# Altium schematic sheet Group14ReceiverSchematic.SchDoc
size B; SheetNumber: 1; SheetTotal: 2
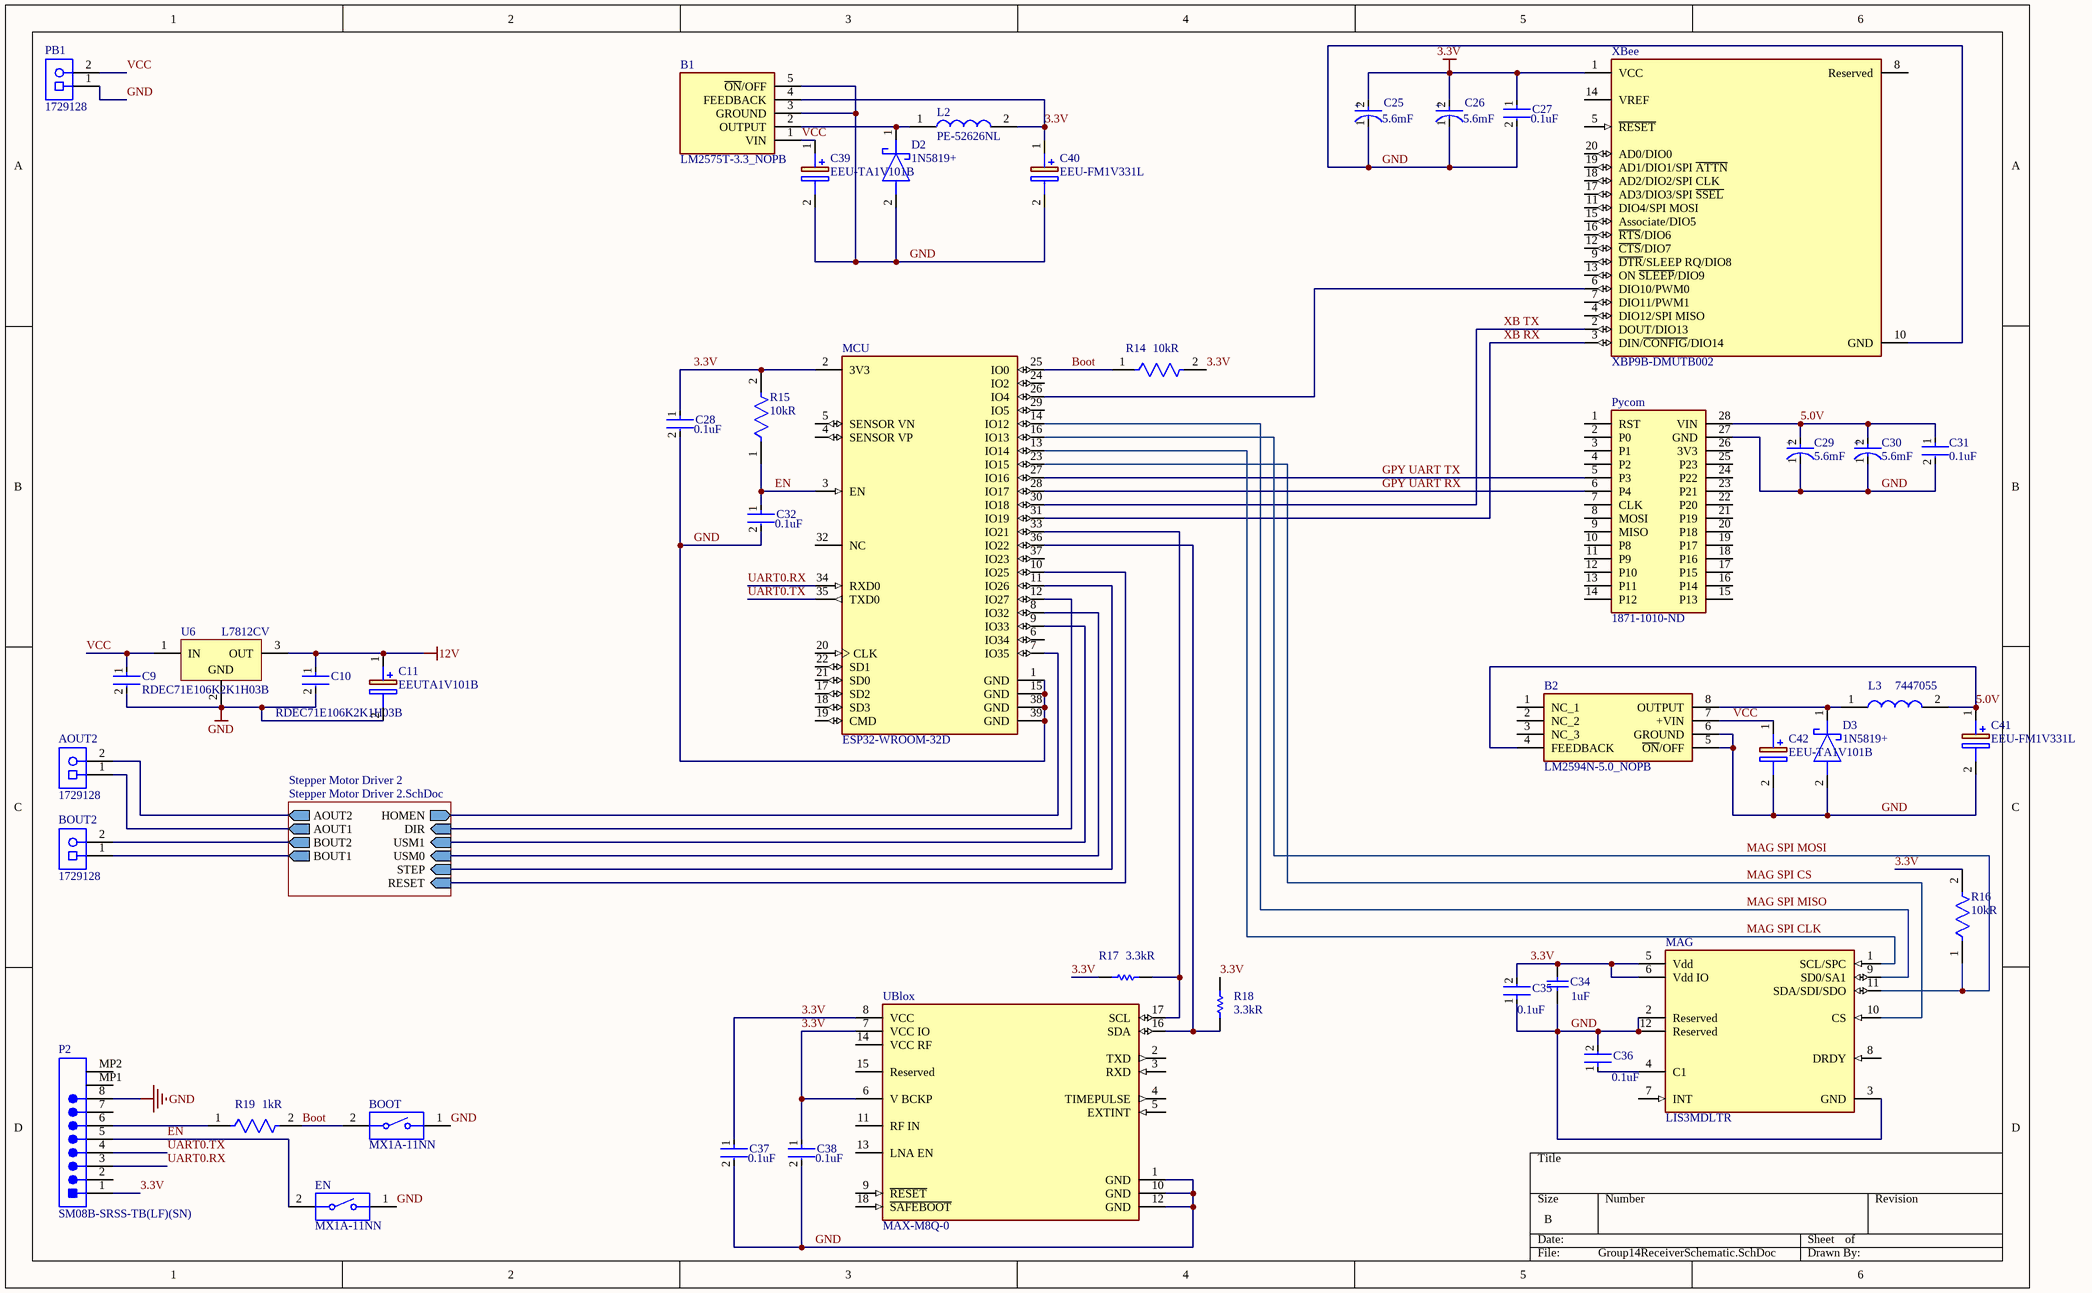
[diagram p0: Group14ReceiverSchematic.SchDoc]

## Parts
AOUT2  1729128  [PHOE-1729128-2_V]
B1  LM2575T-3.3_NOPB  [LM2575T33NOPB]
B2  LM2594N-5.0_NOPB  [DIP794W53P254L959H508Q8N]
BOOT  MX1A-11NN  [CHRY-MX1A-11NN_V]
BOUT2  1729128  [PHOE-1729128-2_V]
C9  RDEC71E106K2K1H03B  [FP-RDE2M1-MFG]
C10  RDEC71E106K2K1H03B  [FP-RDE2M1-MFG]
C11  EEUTA1V101B  [CAPPRD500W65D1000H1350]
C25  Capacitance: 5.6mF  [FP-RAD-TH-D_16_0_5-L_20_2-MFG]  (hidden comment: EEUFM0J562S)
C26  Capacitance: 5.6mF  [FP-RAD-TH-D_16_0_5-L_20_2-MFG]  (hidden comment: EEUFM0J562S)
C27  Capacitance: 0.1uF  [FP-RCE0K1-MFG]  (hidden comment: RCER71E104K0K1H03B)
C28  Capacitance: 0.1uF  [FP-RCE0K1-MFG]  (hidden comment: RCER71E104K0K1H03B)
C29  Capacitance: 5.6mF  [FP-RAD-TH-D_16_0_5-L_20_2-MFG]  (hidden comment: EEUFM0J562S)
C30  Capacitance: 5.6mF  [FP-RAD-TH-D_16_0_5-L_20_2-MFG]  (hidden comment: EEUFM0J562S)
C31  Capacitance: 0.1uF  [FP-RCE0K1-MFG]  (hidden comment: RCER71E104K0K1H03B)
C32  Capacitance: 0.1uF  [FP-RCE0K1-MFG]  (hidden comment: RCER71E104K0K1H03B)
C34  Capacitance: 1uF  [CAPC2013X140X50ML20T25]  (hidden comment: 0805YC105JAT2A)
C35  Capacitance: 0.1uF  [FP-RCE0K1-MFG]  (hidden comment: RCER71E104K0K1H03B)
C36  Capacitance: 0.1uF  [FP-RCE0K1-MFG]  (hidden comment: RCER71E104K0K1H03B)
C37  Capacitance: 0.1uF  [FP-RCE0K1-MFG]  (hidden comment: RCER71E104K0K1H03B)
C38  Capacitance: 0.1uF  [FP-RCE0K1-MFG]  (hidden comment: RCER71E104K0K1H03B)
C39  EEU-TA1V101B  [CAPPRD500W65D1000H1350]
C40  EEU-FM1V331L  [CAPPRD350W60D800H2200]
C41  EEU-FM1V331L  [CAPPRD350W60D800H2200]
C42  EEU-TA1V101B  [CAPPRD500W65D1000H1350]
D2  1N5819+  [DIOAD1410W86L470D235]
D3  1N5819+  [DIOAD1410W86L470D235]
EN  MX1A-11NN  [CHRY-MX1A-11NN_V]
L2  PE-52626NL  [PE52626NL]
L3  7447055  [7447055]
MAG  LIS3MDLTR  [FP-VFLGA-12-8365767-MFG]
MCU  ESP32-WROOM-32D  [FP-ESP32-WROOM-32D-MFG]
P2  SM08B-SRSS-TB(LF)(SN)  [JST-SM08B-SRSS-TB_V]
PB1  1729128  [PHOE-1729128-2_V]
Pycom  1871-1010-ND  [18711010ND]
R14  Resistance: 10kR  [FP-CR0805-IPC_A]  (hidden comment: CR0805-FX-1002ELF)
R15  Resistance: 10kR  [FP-CR0805-IPC_A]  (hidden comment: CR0805-FX-1002ELF)
R16  Resistance: 10kR  [FP-CR0805-IPC_A]  (hidden comment: CR0805-FX-1002ELF)
R17  Resistance: 3.3kR  [RESC1608X55X30NL20T10]  (hidden comment: RK73H1JTTD3301F)
R18  Resistance: 3.3kR  [RESC1608X55X30NL20T10]  (hidden comment: RK73H1JTTD3301F)
R19  1kR  [FP-RN732A-MFG]
U6  L7812CV  [TO220]
UBlox  MAX-M8Q-0  [FP-MAX-M8Q-0-MFG]
XBee  XBP9B-DMUTB002  [FP-XBP9B-DMUTB002-MFG]

## Sub-sheets
Stepper Motor Driver 2 = Stepper Motor Driver 2.SchDoc: HOMEN (out), DIR (in), USM1 (in), USM0 (in), STEP (in), RESET (in), AOUT1 (out), AOUT2 (out), BOUT2 (out), BOUT1 (out)

## Nets
3.3V: B1.4(FEEDBACK) C25.2(A) C26.2(A) C27.1 C28.1 C34.2 C35.2 C37.1 C38.1 C40.1(+) L2.2 MAG.5(Vdd) MAG.6(Vdd_IO) MCU.2(3V3) P2.1 R14.2 R15.2 R16.2 R17.2 R18.2 UBlox.6(V_BCKP) UBlox.7(VCC_IO) UBlox.8(VCC) XBee.1(VCC)
12V: C10.1 C11.1(+) U6.3(OUT)
GND: B1.3(GROUND) B1.5(~{ON}/OFF) B2.5(~{ON}/OFF) B2.6(GROUND) BOOT.1 C9.2 C10.2 C11.2(-) C25.1(C) C26.1(C) C27.2 C28.2 C29.1(C) C30.1(C) C31.2 C32.2 C34.1 C35.1 C36.2 C37.2 C38.2 C39.2(-) C40.2(-) C41.2(-) C42.2(-) D2.2(A) D3.2(A) EN.1 MAG.2(Reserved) MAG.3(GND) MAG.12(Reserved) MCU.1(GND) MCU.15(GND) MCU.38(GND) MCU.39(GND) P2.8 PB1.1 Pycom.27(GND) U6.2(GND) UBlox.1(GND) UBlox.10(GND) UBlox.12(GND) XBee.10(GND)
5.0V: B2.4(FEEDBACK) C29.2(A) C30.2(A) C31.1 C41.1(+) L3.2 Pycom.28(VIN)
Boot: BOOT.2 MCU.25(IO0) R14.1 R19.2
EN: C32.1 EN.2 MCU.3(EN) P2.5 R15.1
GPY UART RX: MCU.28(IO17) Pycom.6(P4)
GPY UART TX: MCU.27(IO16) Pycom.5(P3)
MAG SPI CLK: MAG.1(SCL/SPC) MCU.13(IO14)
MAG SPI CS: MAG.10(CS) MCU.23(IO15)
MAG SPI MISO: MAG.9(SD0/SA1) MCU.14(IO12)
MAG SPI MOSI: MAG.11(SDA/SDI/SDO) MCU.16(IO13) R16.1
UART0.RX: MCU.34(RXD0) P2.3
UART0.TX: MCU.35(TXD0) P2.4
VCC: B1.1(VIN) B2.7(+VIN) C9.1 C39.1(+) C42.1(+) PB1.2 U6.1(IN)
XB RX: MCU.31(IO19) XBee.3(DIN/~{CONFIG}/DIO14)
XB TX: MCU.30(IO18) XBee.2(DOUT/DIO13)
NetAOUT2_1: AOUT2.1 ; sheet Stepper Motor Driver 2/AOUT1
NetAOUT2_2: AOUT2.2 ; sheet Stepper Motor Driver 2/AOUT2
NetB1_2: B1.2(OUTPUT) D2.1(K) L2.1
NetB2_8: B2.8(OUTPUT) D3.1(K) L3.1
NetBOUT2_1: BOUT2.1 ; sheet Stepper Motor Driver 2/BOUT1
NetBOUT2_2: BOUT2.2 ; sheet Stepper Motor Driver 2/BOUT2
NetC36_1: C36.1 MAG.4(C1)
NetMCU_7: MCU.7(IO35) ; sheet Stepper Motor Driver 2/HOMEN
NetMCU_8: MCU.8(IO32) ; sheet Stepper Motor Driver 2/USM0
NetMCU_9: MCU.9(IO33) ; sheet Stepper Motor Driver 2/USM1
NetMCU_10: MCU.10(IO25) ; sheet Stepper Motor Driver 2/RESET
NetMCU_11: MCU.11(IO26) ; sheet Stepper Motor Driver 2/STEP
NetMCU_12: MCU.12(IO27) ; sheet Stepper Motor Driver 2/DIR
NetMCU_26: MCU.26(IO4) XBee.6(DIO10/PWM0)
NetMCU_33: MCU.33(IO21) R17.1 UBlox.17(SCL)
NetMCU_36: MCU.36(IO22) R18.1 UBlox.16(SDA)
NetP2_6: P2.6 R19.1

Not connected (* = marked no-connect by the designer): B2 1(NC_1) 2(NC_2) 3(NC_3); MAG 7(INT) 8(DRDY); MCU 4(SENSOR_VP) 5(SENSOR_VN) 6(IO34) 17(SD2) 18(SD3) 19(CMD) 20(CLK) 21(SD0) 22(SD1) 24(IO2) 29(IO5) 32(NC) 37(IO23); P2 2 7 MP1 MP2; Pycom 1(RST) 2(P0) 3(P1) 4(P2) 7(CLK) 8(MOSI) 9(MISO) 10(P8) 11(P9) 12(P10) 13(P11) 14(P12) 15(P13) 16(P14) 17(P15) 18(P16) 19(P17) 20(P18) 21(P19) 22(P20) 23(P21) 24(P22) 25(P23) 26(3V3); UBlox 2(TXD) 3(RXD) 4(TIMEPULSE) 5(EXTINT) 9(~{RESET}) 11(RF_IN) 13(LNA_EN) 14(VCC_RF) 15(Reserved) 18(~{SAFEBOOT}); XBee 4(DIO12/SPI_MISO) 5(~{RESET}) 7(DIO11/PWM1) 8(Reserved) 9(~{DTR}/SLEEP_RQ/DIO8) 11(DIO4/SPI_MOSI) 12(~{CTS}/DIO7) 13(ON_~{SLEEP}/DIO9) 14(VREF) 15(Associate/DIO5) 16(~{RTS}/DIO6) 17(AD3/DIO3/SPI_~{SSEL}) 18(AD2/DIO2/SPI_CLK) 19(AD1/DIO1/SPI_~{ATTN}) 20(AD0/DIO0)

## Notes on the sheet
- (in symbol CMP-05427-001489-1) +

## Library data of the parts
AOUT2 BOUT2 PB1 = CMP-2000-05815-1: PCB Terminal Block, 13.5 A, 400 V, 2-Pin THD, RoHS, Bulk; Manufacturer: Phoenix Contact; Package Version: 03/2015; No. of Rows: 1; Pitch: 5.08mm; No. of Positions: 2; Voltage Rating: 400V; Current Rating: 13500mA; Manufacturer URL: http://www.phoenixcontact.com/; Datasheet URL: https://datasheet.ciiva.com/16046/1729128-16046181.pdf; RoHS: TRUE; Package URL: https://www.phoenixcontact.com/online/portal/pi/pxc/product_detail_page/!ut/p/b1/3VdJjqNKFDxLH8AFycySyWY2ozFsEPOMMQaDOX1XedGL_1Vdm5YXJleknhSKeBkvI6EA8ncAo3AYoDhBQGco6KN7VURTdemj9us_IEKEZo_YHiPAEWEFmDGOHMORkqKYCORBZxgL7ZoaZYcbFFUZ3fqxSY6GOuxydWUuHqz1ynmMFygu583Bob0Ewr6Sd_l-5m-kAueHiB0jpRwZwe58wwtkpxtMYd_LmGcDRU02dRNEyWt6Y2ti5pSyJ_reIkzIulrqApdnbT11V5jnCKbYNCvhEM1MCpPByat_X379-iThf08CI5GfOPqfBeS3BRoBOdD55AKVv0iLwCMq-2BrzXWSGRH7pUGD9uwXQjiph3xL0DKQwdGa0JImiIOmBNOestqgwTHSSs2oOep-78apyXQBvNi8ZLaFjvjWvcaUEBu0MC6Wbe-d6mB0FAebo2lUWinqYaZs5DAYzV0RP9yitUjnGJ0iI9xhZkT42OCQNUJJhkgWINNQLP2JFP6OpMg3JCVg70jqHT0lvKOnhHf0lPuOnnLf0VPuWx6_dxwUIvwk5WMkT0kLL1mh61l2yZVSzG3pYV_bqo-mj6uMKwKwdnnW8Jh5RTOJzMOA5c-eJDaZQw4mTMPH02PvS_ZAqNVjVTo2WyYLkwH_KU1mmmG5kjRhDqPXLwwVHvVOjCM60-fpXvTDfMGW1PVFVS1r4e4yVDk4ZdNbkUHvqPqQSeian4UD39fNKmachqdJ1NJbyk8rXT9mXTvPk3oE5meulKGgiruPJek-4I9hTT6G8ZLOyRSm2RRVbThERQad5OS28hdt4YW4vG0stgYYzsWsK4_7y6DZMjJSCqri1kyiZR5vD7pwIrNR7QwPHTcLTI5qT7eRlpHrdGiupYlqQDJ7zy_CND8fWWBoLRXxk1RVcXiBQwbTD4Xi7KL-FuO94t9xaqweXzH; PartNumber: 1729128; Package Description: 2-Pin Through Hole Device, Body 8.1 x 10.16 mm, Pitch 5.08 mm; Datasheet Version: 12/2013; Mounting Technology: ThroughHole; Orientation: Horizontal; Package Reference: 1729128-2; Packing: Bulk
B1 = LM2575T-3.3_NOPB: Integrated Circuit; Manufacturer_Name: Texas Instruments; Manufacturer_Part_Number: LM2575T-3.3/NOPB; Datasheet Link: http://www.ti.com/general/docs/suppproductinfo.tsp?distId=26&gotoUrl=http%3A%2F%2Fwww.ti.com%2Flit%2Fgpn%2Flm2575-n; Height: 16.11mm; Mouser Part Number: 926-LM2575T-33/NOPB; Mouser Price/Stock: https://www.mouser.co.uk/ProductDetail/Texas-Instruments/LM2575T-33-NOPB?qs=X1J7HmVL2ZHjtzlSRCfbrw%3D%3D
B2 = LM2594N-5.0_NOPB: Integrated Circuit; Manufacturer_Name: Texas Instruments; Manufacturer_Part_Number: LM2594N-5.0/NOPB; Datasheet Link: http://www.ti.com/lit/gpn/lm2594; Height: 5.08mm; Mouser Part Number: 926-LM2594N-5.0/NOPB; Mouser Price/Stock: https://www.mouser.co.uk/ProductDetail/Texas-Instruments/LM2594N-50-NOPB?qs=X1J7HmVL2ZE%252BqgrH92eJ%252Bw%3D%3D; Arrow Part Number: LM2594N-5.0/NOPB; Arrow Price/Stock: https://www.arrow.com/en/products/lm2594n-5.0nopb/texas-instruments?region=nac
BOOT EN = CMP-2000-06785-1: Keymodule MX, SPST, IP40, 12 V Max, 10 mA Max, -10 to 70 degC, 2-Pin THD, RoHS, Bulk; Part No: MX1A11NN; Manufacturer: Cherry; Body Orientation: Straight; Total Travel: 4.06mm; Actuator Style: Button; Minimum Insulation Resistance: 100MOhm; Maximum Current Rating: 0.01A; Maximum Contact Resistance: 200mOhm; Operating Force: 0.58N; Actuator Length: 3.6mm; Maximum DC Voltage Rating: 12V; Illumination Type: N/R; Row Spacing: 6.35mm; Switch Configuration: N.O.; Electrical Life: 50000000Cycles; Type: DesktopProfile; Operating Temperature: -10to70C; Actuator Material: N/A; Supplier: CherryElectrical; Packaging: N/A; Contact Plating: N/A; Terminal Type: PCPins; Mechanical Life: N/A; Package Description: 2-Pin Through Hole Switch, Body 15.6 x 15.6 mm; Package Reference: MX1A-11NN; ECCN: EAR99; RoHS: Unknown; Contact Material: Silver/Gold; Datasheet URL: http://www.cherry.de/PDF/EN_CHERRY_MX1A-1xxx.pdf; Datasheet Version: 02/2016; Family: MX; Number of Terminals: 2; IP Rating: N/A; Pole Throw Configuration: SPST; Terminal Pitch: 2.54mm; Dielectric Strength: N/A; Actuator Color: N/A; Manufacturer URL: http://cherryswitches.com/cn/; HTS: 8536509065; Maximum Power Rating: N/A; Illumination Color: N/R; Dimension: 15.6x15.6x15.2mm; Housing Material: N/A; Maximum AC Voltage Rating: 12V; Package URL: http://cherryamericas.com/wp-content/uploads/2014/12/mx_cat.pdf; Mounting Technology: ThroughHole; Mounting: ThroughHole; Operating Speed: N/A
C9 C10 = CMP-06035-050717-1: Ceramic Capacitor 10uF ±10% 25V X7S Radial; Lead/Base Style: Formed Leads; Lead Diameter: 0.5mm; Max Operating Temperature: 125°C; Voltage Rating (DC): 25V; Tolerance: 10%; Termination: Radial; Packaging: Bulk; Voltage Rating: 25V; Mount: Through Hole; Case/Package: Radial; Height: 4mm; Capacitance: 10uF; Resistor Type: Ceramic; Package Quantity: 500; Dielectric: X7S; Height - Seated (Max): 0.236inch; Length: 5.5mm; Width: 0.124inch; Lead Free: Lead Free; Lead Pitch: 0.197inch; Min Operating Temperature: -55°C
C11 = EEUTA1V101B: Capacitor Polarised; Manufacturer_Name: Panasonic; Datasheet Link: http://industrial.panasonic.com/cdbs/www-data/pdf/RDF0000/ABA0000C1212.pdf; Height: 13.5mm; Manufacturer_Part_Number: EEUTA1V101B
C25 C26 C29 C30 = CMP-05427-001489-1: Aluminum Electrolytic Capacitors (Radial Lead Type) 5600uF ±20% 6.3V; ESR (Equivalent Series Resistance): 17mR; Ripple Current: 3.3A; Lead/Base Style: Straight; Dissipation Factor: 0.22%; Lead Diameter: 0.8mm; Life (Hours): 5000Hour; Lead Free: Lead Free; Construction: RADIAL; Voltage Rating (DC): 6.3V; Tolerance: 20%; Voltage: 6.3V; Height: 20mm; Radiation Hardening: No; Case/Package: Radial; Series: FM; Package Quantity: 100; Length: 20mm; Packaging: Bulk; Diameter: 16mm; Mount: Through Hole; Termination: Radial; Height - Seated (Max): 0.866inch; Min Operating Temperature: -40°C; Impedance: 17mR; RoHS Compliant: Yes; Max Operating Temperature: 105°C; Lead Pitch: 7.5mm; Voltage Rating: 6.3V; REACH SVHC: No SVHC
C27 C28 C31 C32 C35-C38 = CMP-06035-038410-1: Cap Ceramic 100nF 25V X7R ±10% Radial 5mm +125°C Automotive Bulk
C34 = CMP-1036-04744-2: Manufacturer: AVX Interconnect / Elco; Part Number: 0805YC105JAT2A
C39 C42 = EEU-TA1V101B: Capacitor Polarised; Manufacturer_Name: Panasonic; Datasheet Link: https://industrial.panasonic.com/cdbs/www-data/pdf/RDF0000/ABA0000C1212.pdf; Height: 13.5mm; Manufacturer_Part_Number: EEU-TA1V101B; Mouser Part Number: 667-EEU-TA1V101B; Mouser Price/Stock: https://www.mouser.co.uk/ProductDetail/Panasonic/EEU-TA1V101B?qs=MtOUKumLmnZREbDRff9Fow%3D%3D
C40 C41 = EEU-FM1V331L: Capacitor Polarised; Manufacturer_Name: Panasonic; Datasheet Link: http://industrial.panasonic.com/cdbs/www-data/pdf/RDF0000/ABA0000C1018.pdf; Height: 22mm; Manufacturer_Part_Number: EEU-FM1V331L; Mouser Part Number: 667-EEU-FM1V331L; Mouser Price/Stock: https://www.mouser.co.uk/ProductDetail/Panasonic/EEU-FM1V331L?qs=S7VFkBl86ApCbSQnnAO5Xw%3D%3D; Arrow Part Number: EEU-FM1V331L; Arrow Price/Stock: https://www.arrow.com/en/products/eeu-fm1v331l/panasonic?region=europe
D2 D3 = 1N5819+: Schottky Diode; Manufacturer_Name: MULTICOMP; Manufacturer_Part_Number: 1N5819+
L2 = PE-52626NL: Inductor; Manufacturer_Name: Pulse; Datasheet Link: https://componentsearchengine.com/Datasheets/1/PE-52626NL.pdf; Height: 11.68mm; Manufacturer_Part_Number: PE-52626NL; Mouser Part Number: 673-PE-52626NL; Mouser Price/Stock: https://www.mouser.co.uk/ProductDetail/Pulse-Electronics/PE-52626NL/?qs=tckYUfRMGW5T0NeUEdkcvw%3D%3D; Arrow Part Number: PE-52626NL; Arrow Price/Stock: https://www.arrow.com/en/products/pe-52626nl/pulse-electronics-corporation
L3 = 7447055: Inductor; Manufacturer_Name: Wurth Elektronik; Datasheet Link: https://www.we-online.de/katalog/datasheet/7447055.pdf; Height: 26mm; Manufacturer_Part_Number: 7447055; Mouser Part Number: 710-7447055; Mouser Price/Stock: https://www.mouser.co.uk/ProductDetail/Wurth-Elektronik/7447055?qs=sPbYRqrBIVlpMfK%252BjxxlvQ%3D%3D
MAG = CMP-2000-07463-2: SENSOR MR I2C/SPI 12LGA; Manufacturer: STMicroelectronics; Sensor Output: I2C,SPI; Operating Supply Current: 40-270uA; Max Supply Voltage: 3.6V; Sensing Method: Magnetic; Min Supply Voltage: 1.71V; ComponentLink2URL: https://www.st.com/resource/en/datasheet/lis3mdl.pdf; Category: IC; Manufacturer Part Number: LIS3MDLTR; Octopart: https://octopart.com/lis3mdltr-stmicroelectronics-29403125; Automotive: No; ComponentLink2Description: Datasheet; RoHS: TRUE; Device Class L3: unset; Device Class L1: Sensors; Temperature: -40°C to +85°C; Height: 1mm; Mouser Description: Board Mount Hall Effect / Magnetic Sensors Ultra Lo-Pwr Hi Perf 3-Axis 1.9-3.6V; Temperature Range High: +85°C; Lead Free: Yes; Device Class L2: Magnetic Sensors; Footprint Url: https://www.st.com/content/ccc/resource/technical/document/technical_note/73/17/9c/16/dd/96/4a/01/CD00134799.pdf/files/CD00134799.pdf/jcr:content/translations/en.CD00134799.pdf; Temperature Range Low: -40°C; Package: VFLGA-12-8365767; Digikey Description: SENSOR MR I2C/SPI 12LGA
MCU = CMP-194065-000003-1: WIFI MODULE 32MBITS SPI FLASH; Manufacturer: Espressif Systems; Max Supply Voltage: 3.6V; Nominal Supply Current: 500mA; Max Frequency: 2484MHz; Number Of Adc Channels: 16; Number Of Gpio: 32; Interface: I2C,SPI,UART,Ethernet,I2S,Other; Data Rate: 150Mbits/s; Min Supply Voltage: 3V; Bandwidth: 72MHz; Sensitivity: -98dBm; Octopart: https://octopart.com/esp32-wroom-32d-espressif+systems-91040050; Package: ESP32-WROOM-32D; ComponentLink2URL: https://www.espressif.com/sites/default/files/documentation/esp32-wroom-32d_esp32-wroom-32u_datasheet_en.pdf; Lead Free: Yes; Category: UNK; Mouser Description: Wi-Fi/BT BLE Module ESP32-D0WD, SPI Flash, UART, P; Device Class L1: Integrated Circuits (ICs); RoHS: TRUE; Temperature Range Low: -40°C; ComponentLink2Description: Datasheet; Digikey Description: WIFI MODULE 32MBITS SPI FLASH; Height: 3.2mm; Temperature: -40°C to +85°C; Manufacturer Part Number: ESP32-WROOM-32D; Device Class L3: Transceivers; Device Class L2: RF Semiconductors and Devices; Temperature Range High: +85°C; Automotive: No
P2 = CMP-2000-07082-1: Male Header, Pitch 1 mm, 1 x 8 Position, Height 2.95 mm, -25 to 85 degC, RoHS, Tape and Reel; Manufacturer: JST; Style/Orientation: RightAngleHeader/Plug; Pitch: 1mm; No of Positions: 8; Manufacturer URL: http://www.jst.com/home2.html; Mounting Technology: SurfaceMount; Package Description: Male Header, Pitch 1 mm, 1 x 8 Position, Height 2.95 mm; Datasheet URL: http://www.jst-mfg.com/product/pdf/eng/eSR.pdf; Type: ShroudedHeader; Termination: Crimp; Package Reference: SM08B-SRSS-TB; Datasheet Version: 11/2010
Pycom = 1871-1010-ND: Integrated Circuit; Manufacturer_Name: Pycom; Datasheet Link: https://docs.pycom.io/gitbook/assets/specsheets/Pycom_002_Specsheets_GPy_v2.pdf; Height: 5.8mm; Manufacturer_Part_Number: 1871-1010-ND
R14-R16 = CMP-07231-003204-1: Thick Film Chip Resistors 0805 10kΩ 0.125W 1% 100ppm/°C; Max Power Dissipation: 125mW; Voltage Rating: 150V; Voltage Rating (DC): 100V; Height: 0.5mm; Tolerance: 1%; Max Operating Temperature: 155°C; Thickness: 508um; Radiation Hardening: No; Packaging: Tape and Reel; Depth: 1.25mm; Contact Plating: Tin; Package Quantity: 1; Case Code (Metric): 2012; REACH SVHC: No SVHC; Min Operating Temperature: -55°C; Power Rating: 125mW; Mount: Surface Mount; Length: 2mm; Case Code (Imperial): 0805; Width: 1.25mm; Temperature Coefficient: 100ppm/°C; Termination: SMD/SMT; Composition: Thick Film; Features: Moisture Resistant; Case/Package: 0805; Number of Terminations: 2
R17 R18 = CMP-2000-01423-1: Manufacturer: KOA Speer; Part Number: RK73H1JTTD3301F
R19 = CMP-03211-005338-1: SMD Chip Resistor, Thin Film, 1.0KΩ, 100 V, 0805 [2012 Metric], 100 mW, 0.1%, RN73 Series; Manufacturer Part Number: RN73C2A1K0B; Manufacturer: TE Connectivity; Temperature Coefficient: 10ppm/°C; Power Rating: 0.1W; Voltage Rating: 100V; Ipc Land Pattern Name: RESC200125X55; Tolerance: 0.1%; Device Class L1: Passive Components; Device Class L3: Chip SMD Resistors; Temperature: -55°C to 155°C; ComponentLink2URL: https://www.te.com/commerce/DocumentDelivery/DDEController?Action=showdoc&DocId=Data+Sheet%7F1773270%7FP%7Fpdf%7FEnglish%7FENG_DS_1773270_P.pdf%7F1676162-2; Series: RN73; Automotive: No; Device Class L2: Resistors; Resistance: 1.0KΩ; Temperature Range High: 155°C; packaging: Custom; Lead Free: Yes; Package: RN732A; Category: Res; ComponentLink2Description: Datasheet; Octopart: https://octopart.com/rn73c2a1k0b-te+connectivity-47108300; Temperature Range Low: -55°C; Value: 1.0KΩ; Composition: Thin Film; RoHS: TRUE; octopart_url: https://octopart.com/rn73c2a1k0b-te+connectivity-47108300; Height: 0.65mm
U6 = CMP-0244-00450-1: Positive Voltage Regulator, 12V, 3-Pin TO-220; PackageDescription: TO, Thru-Hole, Vertical, Heatsink Mounted; 3 In-Line Leads; Pitch 2.54 mm; ComponentLink3URL: http://www.st.com/internet/com/TECHNICAL_RESOURCES/TECHNICAL_LITERATURE/PACKAGE_INFORMATION/CD00004649.pdf; ComponentLink1URL: http://www.st.com; ComponentLink2Description: Datasheet; ComponentLink3Description: Package Specification; ComponentLink2URL: http://www.st.com/internet/com/TECHNICAL_RESOURCES/TECHNICAL_LITERATURE/DATASHEET/CD00000444.pdf; DatasheetVersion: 16/11/2011; PackageVersion: ver3.0; PackageReference: TO220; ComponentLink1Description: Manufacturer URL
UBlox = CMP-207130-000017-1: RF RCVR GNSS/GPS 1.575GHZ 18LCC; Sensitivity: -167dBm; Current - Receiving: 23mA; Interface: I2C; Frequency: 1.575GHz; Min Operating Temperature: -40°C; Case/Package: SMD/SMT; RoHS Compliant: Yes; Packaging: Cut Tape; Max Operating Temperature: 85°C
XBee = CMP-84319-000004-1: RX TXRX MOD ISM < 1GHZ U.FL TH; Max Supply Voltage: 3.6V; Current - Transmitting: 215mA; Sensitivity: -101dBm; Min Frequency: 902MHz; Memory Size: 2KB; Max Frequency: 928MHz; Min Supply Voltage: 2.4V; Current - Receiving: 29mA; Interface: SPI; Data Rate: 200Kbps; Frequency: 900MHz; Output Power (dBm): 24dBm; Number of Pins: 20; Series: XBee-Pro™; Max Operating Temperature: 85°C; Radiation Hardening: No; Min Operating Temperature: -40°C; Package Quantity: 1; RAM Size: 2KB; Packaging: Bulk; Case/Package: Module